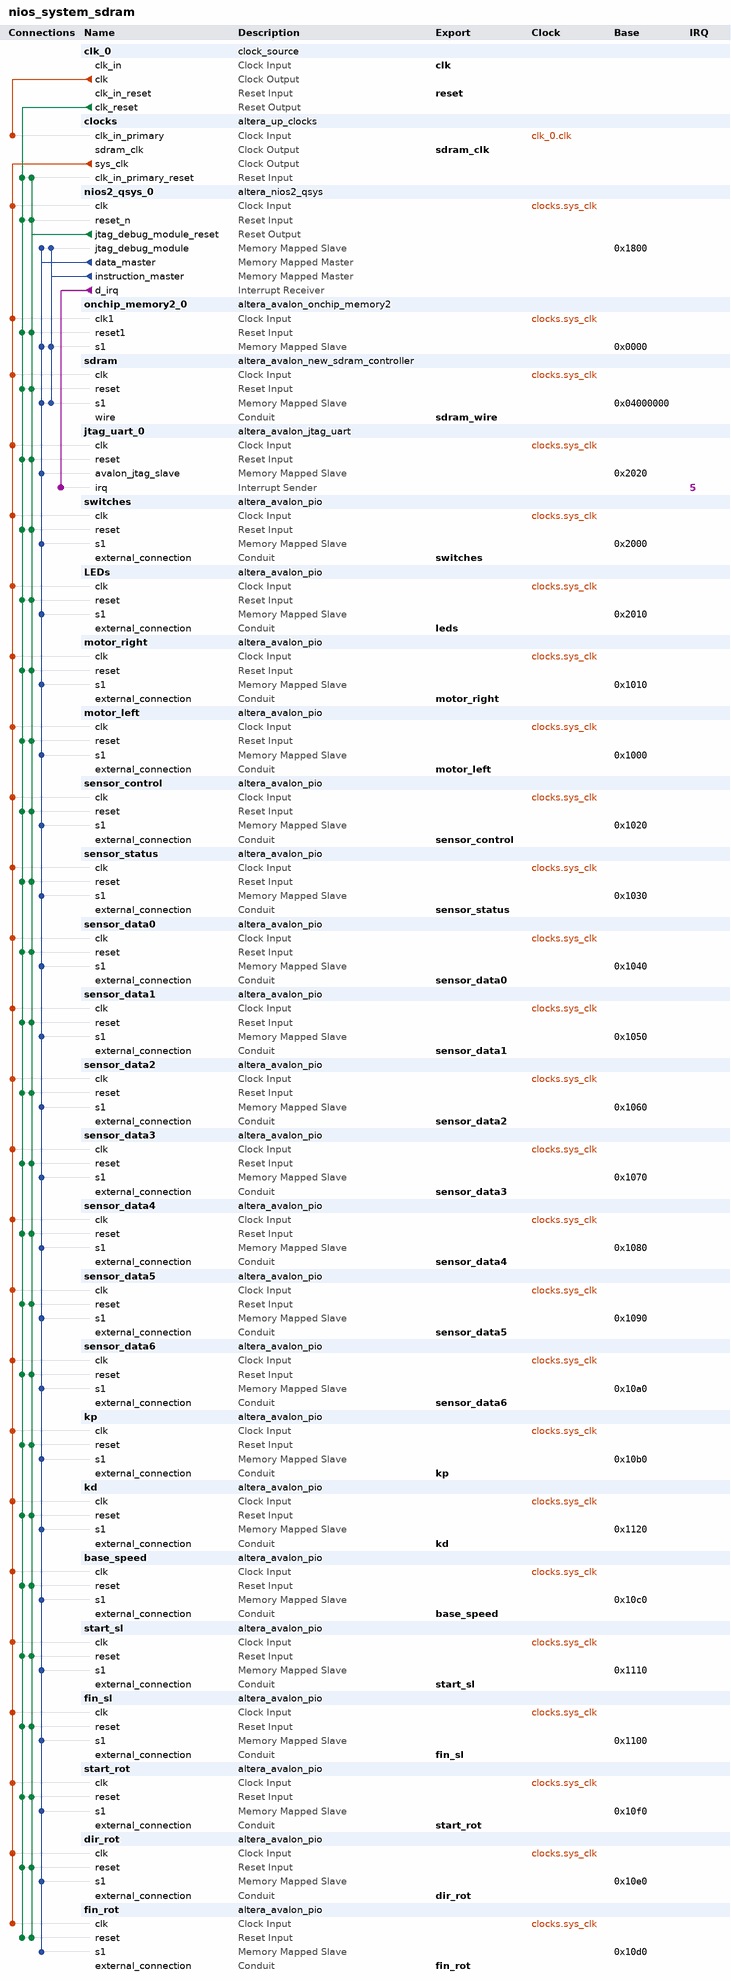
[diagram p0: system contents]
# Platform Designer (Qsys) system nios_system_sdram, Cyclone IV E EP4CE22F17C6
# Parameters at their usual value, and those the tool derives, are not listed.
package require -exact qsys 13.0.1.99.2
create_system nios_system_sdram
set_project_property DEVICE_FAMILY {Cyclone IV E}
set_project_property DEVICE EP4CE22F17C6

add_instance clk_0 clock_source 13.0
set_instance_parameter_value clk_0 clockFrequency 50000000

add_instance clocks altera_up_clocks 13.0
set_instance_parameter_value clocks board DE0-Nano
set_instance_parameter_value clocks vga_clk false
set_instance_parameter_value clocks audio_clk true
set_instance_parameter_value clocks audio_clk_freq 12.288

add_instance nios2_qsys_0 altera_nios2_qsys 13.0
set_instance_parameter_value nios2_qsys_0 resetSlave sdram.s1
set_instance_parameter_value nios2_qsys_0 mmu_TLBMissExcSlave None
set_instance_parameter_value nios2_qsys_0 exceptionSlave sdram.s1
set_instance_parameter_value nios2_qsys_0 breakSlave nios2_qsys_0.jtag_debug_module
set_instance_parameter_value nios2_qsys_0 impl Tiny
set_instance_parameter_value nios2_qsys_0 icache_size 4096

add_instance onchip_memory2_0 altera_avalon_onchip_memory2 13.0.1.99.2
set_instance_parameter_value onchip_memory2_0 dataWidth 32
set_instance_parameter_value onchip_memory2_0 dualPort false
set_instance_parameter_value onchip_memory2_0 initMemContent true
set_instance_parameter_value onchip_memory2_0 initializationFileName onchip_mem.hex
set_instance_parameter_value onchip_memory2_0 memorySize 4096

add_instance sdram altera_avalon_new_sdram_controller 13.0.1.99.2
set_instance_parameter_value sdram TAC 5.5
set_instance_parameter_value sdram TRCD 20.0
set_instance_parameter_value sdram TRP 20.0
set_instance_parameter_value sdram casLatency 3
set_instance_parameter_value sdram columnWidth 9
set_instance_parameter_value sdram dataWidth 16
set_instance_parameter_value sdram generateSimulationModel false
set_instance_parameter_value sdram model single_Micron_MT48LC4M32B2_7_chip
set_instance_parameter_value sdram numberOfBanks 4
set_instance_parameter_value sdram numberOfChipSelects 1
set_instance_parameter_value sdram powerUpDelay 100.0
set_instance_parameter_value sdram refreshPeriod 15.625
set_instance_parameter_value sdram rowWidth 13

add_instance jtag_uart_0 altera_avalon_jtag_uart 13.0.1.99.2
set_instance_parameter_value jtag_uart_0 simInteractiveOptions NO_INTERACTIVE_WINDOWS

add_instance switches altera_avalon_pio 13.0.1.99.2
set_instance_parameter_value switches direction Input
set_instance_parameter_value switches width 8

add_instance LEDs altera_avalon_pio 13.0.1.99.2
set_instance_parameter_value LEDs direction Output
set_instance_parameter_value LEDs width 8

add_instance motor_right altera_avalon_pio 13.0.1.99.2
set_instance_parameter_value motor_right direction Output
set_instance_parameter_value motor_right width 14

add_instance motor_left altera_avalon_pio 13.0.1.99.2
set_instance_parameter_value motor_left direction Output
set_instance_parameter_value motor_left width 14

add_instance sensor_control altera_avalon_pio 13.0.1.99.2
set_instance_parameter_value sensor_control direction Output
set_instance_parameter_value sensor_control width 8

add_instance sensor_status altera_avalon_pio 13.0.1.99.2
set_instance_parameter_value sensor_status direction Input
set_instance_parameter_value sensor_status width 8

add_instance sensor_data0 altera_avalon_pio 13.0.1.99.2
set_instance_parameter_value sensor_data0 direction Input
set_instance_parameter_value sensor_data0 width 8

add_instance sensor_data1 altera_avalon_pio 13.0.1.99.2
set_instance_parameter_value sensor_data1 direction Input
set_instance_parameter_value sensor_data1 width 8

add_instance sensor_data2 altera_avalon_pio 13.0.1.99.2
set_instance_parameter_value sensor_data2 direction Input
set_instance_parameter_value sensor_data2 width 8

add_instance sensor_data3 altera_avalon_pio 13.0.1.99.2
set_instance_parameter_value sensor_data3 direction Input
set_instance_parameter_value sensor_data3 width 8

add_instance sensor_data4 altera_avalon_pio 13.0.1.99.2
set_instance_parameter_value sensor_data4 direction Input
set_instance_parameter_value sensor_data4 width 8

add_instance sensor_data5 altera_avalon_pio 13.0.1.99.2
set_instance_parameter_value sensor_data5 direction Input
set_instance_parameter_value sensor_data5 width 8

add_instance sensor_data6 altera_avalon_pio 13.0.1.99.2
set_instance_parameter_value sensor_data6 direction Input
set_instance_parameter_value sensor_data6 width 8

add_instance kp altera_avalon_pio 13.0.1.99.2
set_instance_parameter_value kp direction Output
set_instance_parameter_value kp resetValue 1000
set_instance_parameter_value kp width 12

add_instance kd altera_avalon_pio 13.0.1.99.2
set_instance_parameter_value kd direction Output
set_instance_parameter_value kd resetValue 50
set_instance_parameter_value kd width 12

add_instance base_speed altera_avalon_pio 13.0.1.99.2
set_instance_parameter_value base_speed direction Output
set_instance_parameter_value base_speed resetValue 1856
set_instance_parameter_value base_speed width 12

add_instance start_sl altera_avalon_pio 13.0.1.99.2
set_instance_parameter_value start_sl direction Output
set_instance_parameter_value start_sl width 1

add_instance fin_sl altera_avalon_pio 13.0.1.99.2
set_instance_parameter_value fin_sl direction Input
set_instance_parameter_value fin_sl width 1

add_instance start_rot altera_avalon_pio 13.0.1.99.2
set_instance_parameter_value start_rot direction Output
set_instance_parameter_value start_rot width 1

add_instance dir_rot altera_avalon_pio 13.0.1.99.2
set_instance_parameter_value dir_rot direction Output
set_instance_parameter_value dir_rot width 1

add_instance fin_rot altera_avalon_pio 13.0.1.99.2
set_instance_parameter_value fin_rot direction Input
set_instance_parameter_value fin_rot width 1

# connections
add_connection clk_0.clk clocks.clk_in_primary clock
add_connection clocks.sys_clk base_speed.clk clock
add_connection clocks.sys_clk dir_rot.clk clock
add_connection clocks.sys_clk fin_rot.clk clock
add_connection clocks.sys_clk fin_sl.clk clock
add_connection clocks.sys_clk jtag_uart_0.clk clock
add_connection clocks.sys_clk kd.clk clock
add_connection clocks.sys_clk kp.clk clock
add_connection clocks.sys_clk LEDs.clk clock
add_connection clocks.sys_clk motor_left.clk clock
add_connection clocks.sys_clk motor_right.clk clock
add_connection clocks.sys_clk nios2_qsys_0.clk clock
add_connection clocks.sys_clk onchip_memory2_0.clk1 clock
add_connection clocks.sys_clk sdram.clk clock
add_connection clocks.sys_clk sensor_control.clk clock
add_connection clocks.sys_clk sensor_data0.clk clock
add_connection clocks.sys_clk sensor_data1.clk clock
add_connection clocks.sys_clk sensor_data2.clk clock
add_connection clocks.sys_clk sensor_data3.clk clock
add_connection clocks.sys_clk sensor_data4.clk clock
add_connection clocks.sys_clk sensor_data5.clk clock
add_connection clocks.sys_clk sensor_data6.clk clock
add_connection clocks.sys_clk sensor_status.clk clock
add_connection clocks.sys_clk start_rot.clk clock
add_connection clocks.sys_clk start_sl.clk clock
add_connection clocks.sys_clk switches.clk clock
add_connection clk_0.clk_reset base_speed.reset reset
add_connection clk_0.clk_reset clocks.clk_in_primary_reset reset
add_connection clk_0.clk_reset dir_rot.reset reset
add_connection clk_0.clk_reset fin_rot.reset reset
add_connection clk_0.clk_reset fin_sl.reset reset
add_connection clk_0.clk_reset jtag_uart_0.reset reset
add_connection clk_0.clk_reset kd.reset reset
add_connection clk_0.clk_reset kp.reset reset
add_connection clk_0.clk_reset LEDs.reset reset
add_connection clk_0.clk_reset motor_left.reset reset
add_connection clk_0.clk_reset motor_right.reset reset
add_connection clk_0.clk_reset nios2_qsys_0.reset_n reset
add_connection clk_0.clk_reset onchip_memory2_0.reset1 reset
add_connection clk_0.clk_reset sdram.reset reset
add_connection clk_0.clk_reset sensor_control.reset reset
add_connection clk_0.clk_reset sensor_data0.reset reset
add_connection clk_0.clk_reset sensor_data1.reset reset
add_connection clk_0.clk_reset sensor_data2.reset reset
add_connection clk_0.clk_reset sensor_data3.reset reset
add_connection clk_0.clk_reset sensor_data4.reset reset
add_connection clk_0.clk_reset sensor_data5.reset reset
add_connection clk_0.clk_reset sensor_data6.reset reset
add_connection clk_0.clk_reset sensor_status.reset reset
add_connection clk_0.clk_reset start_rot.reset reset
add_connection clk_0.clk_reset start_sl.reset reset
add_connection clk_0.clk_reset switches.reset reset
add_connection nios2_qsys_0.jtag_debug_module_reset base_speed.reset reset
add_connection nios2_qsys_0.jtag_debug_module_reset clocks.clk_in_primary_reset reset
add_connection nios2_qsys_0.jtag_debug_module_reset dir_rot.reset reset
add_connection nios2_qsys_0.jtag_debug_module_reset fin_rot.reset reset
add_connection nios2_qsys_0.jtag_debug_module_reset fin_sl.reset reset
add_connection nios2_qsys_0.jtag_debug_module_reset jtag_uart_0.reset reset
add_connection nios2_qsys_0.jtag_debug_module_reset kd.reset reset
add_connection nios2_qsys_0.jtag_debug_module_reset kp.reset reset
add_connection nios2_qsys_0.jtag_debug_module_reset LEDs.reset reset
add_connection nios2_qsys_0.jtag_debug_module_reset motor_left.reset reset
add_connection nios2_qsys_0.jtag_debug_module_reset motor_right.reset reset
add_connection nios2_qsys_0.jtag_debug_module_reset nios2_qsys_0.reset_n reset
add_connection nios2_qsys_0.jtag_debug_module_reset onchip_memory2_0.reset1 reset
add_connection nios2_qsys_0.jtag_debug_module_reset sdram.reset reset
add_connection nios2_qsys_0.jtag_debug_module_reset sensor_control.reset reset
add_connection nios2_qsys_0.jtag_debug_module_reset sensor_data0.reset reset
add_connection nios2_qsys_0.jtag_debug_module_reset sensor_data1.reset reset
add_connection nios2_qsys_0.jtag_debug_module_reset sensor_data2.reset reset
add_connection nios2_qsys_0.jtag_debug_module_reset sensor_data3.reset reset
add_connection nios2_qsys_0.jtag_debug_module_reset sensor_data4.reset reset
add_connection nios2_qsys_0.jtag_debug_module_reset sensor_data5.reset reset
add_connection nios2_qsys_0.jtag_debug_module_reset sensor_data6.reset reset
add_connection nios2_qsys_0.jtag_debug_module_reset sensor_status.reset reset
add_connection nios2_qsys_0.jtag_debug_module_reset start_rot.reset reset
add_connection nios2_qsys_0.jtag_debug_module_reset start_sl.reset reset
add_connection nios2_qsys_0.jtag_debug_module_reset switches.reset reset
add_connection nios2_qsys_0.data_master base_speed.s1 avalon
set_connection_parameter_value nios2_qsys_0.data_master/base_speed.s1 baseAddress 0x10c0
add_connection nios2_qsys_0.data_master dir_rot.s1 avalon
set_connection_parameter_value nios2_qsys_0.data_master/dir_rot.s1 baseAddress 0x10e0
add_connection nios2_qsys_0.data_master fin_rot.s1 avalon
set_connection_parameter_value nios2_qsys_0.data_master/fin_rot.s1 baseAddress 0x10d0
add_connection nios2_qsys_0.data_master fin_sl.s1 avalon
set_connection_parameter_value nios2_qsys_0.data_master/fin_sl.s1 baseAddress 0x1100
add_connection nios2_qsys_0.data_master jtag_uart_0.avalon_jtag_slave avalon
set_connection_parameter_value nios2_qsys_0.data_master/jtag_uart_0.avalon_jtag_slave baseAddress 0x2020
add_connection nios2_qsys_0.data_master kd.s1 avalon
set_connection_parameter_value nios2_qsys_0.data_master/kd.s1 baseAddress 0x1120
add_connection nios2_qsys_0.data_master kp.s1 avalon
set_connection_parameter_value nios2_qsys_0.data_master/kp.s1 baseAddress 0x10b0
add_connection nios2_qsys_0.data_master LEDs.s1 avalon
set_connection_parameter_value nios2_qsys_0.data_master/LEDs.s1 baseAddress 0x2010
add_connection nios2_qsys_0.data_master motor_left.s1 avalon
set_connection_parameter_value nios2_qsys_0.data_master/motor_left.s1 baseAddress 0x1000
add_connection nios2_qsys_0.data_master motor_right.s1 avalon
set_connection_parameter_value nios2_qsys_0.data_master/motor_right.s1 baseAddress 0x1010
add_connection nios2_qsys_0.data_master nios2_qsys_0.jtag_debug_module avalon
set_connection_parameter_value nios2_qsys_0.data_master/nios2_qsys_0.jtag_debug_module baseAddress 0x1800
add_connection nios2_qsys_0.data_master onchip_memory2_0.s1 avalon
set_connection_parameter_value nios2_qsys_0.data_master/onchip_memory2_0.s1 baseAddress 0x0000
add_connection nios2_qsys_0.data_master sdram.s1 avalon
set_connection_parameter_value nios2_qsys_0.data_master/sdram.s1 baseAddress 0x04000000
add_connection nios2_qsys_0.data_master sensor_control.s1 avalon
set_connection_parameter_value nios2_qsys_0.data_master/sensor_control.s1 baseAddress 0x1020
add_connection nios2_qsys_0.data_master sensor_data0.s1 avalon
set_connection_parameter_value nios2_qsys_0.data_master/sensor_data0.s1 baseAddress 0x1040
add_connection nios2_qsys_0.data_master sensor_data1.s1 avalon
set_connection_parameter_value nios2_qsys_0.data_master/sensor_data1.s1 baseAddress 0x1050
add_connection nios2_qsys_0.data_master sensor_data2.s1 avalon
set_connection_parameter_value nios2_qsys_0.data_master/sensor_data2.s1 baseAddress 0x1060
add_connection nios2_qsys_0.data_master sensor_data3.s1 avalon
set_connection_parameter_value nios2_qsys_0.data_master/sensor_data3.s1 baseAddress 0x1070
add_connection nios2_qsys_0.data_master sensor_data4.s1 avalon
set_connection_parameter_value nios2_qsys_0.data_master/sensor_data4.s1 baseAddress 0x1080
add_connection nios2_qsys_0.data_master sensor_data5.s1 avalon
set_connection_parameter_value nios2_qsys_0.data_master/sensor_data5.s1 baseAddress 0x1090
add_connection nios2_qsys_0.data_master sensor_data6.s1 avalon
set_connection_parameter_value nios2_qsys_0.data_master/sensor_data6.s1 baseAddress 0x10a0
add_connection nios2_qsys_0.data_master sensor_status.s1 avalon
set_connection_parameter_value nios2_qsys_0.data_master/sensor_status.s1 baseAddress 0x1030
add_connection nios2_qsys_0.data_master start_rot.s1 avalon
set_connection_parameter_value nios2_qsys_0.data_master/start_rot.s1 baseAddress 0x10f0
add_connection nios2_qsys_0.data_master start_sl.s1 avalon
set_connection_parameter_value nios2_qsys_0.data_master/start_sl.s1 baseAddress 0x1110
add_connection nios2_qsys_0.data_master switches.s1 avalon
set_connection_parameter_value nios2_qsys_0.data_master/switches.s1 baseAddress 0x2000
add_connection nios2_qsys_0.instruction_master nios2_qsys_0.jtag_debug_module avalon
set_connection_parameter_value nios2_qsys_0.instruction_master/nios2_qsys_0.jtag_debug_module baseAddress 0x1800
add_connection nios2_qsys_0.instruction_master onchip_memory2_0.s1 avalon
set_connection_parameter_value nios2_qsys_0.instruction_master/onchip_memory2_0.s1 baseAddress 0x0000
add_connection nios2_qsys_0.instruction_master sdram.s1 avalon
set_connection_parameter_value nios2_qsys_0.instruction_master/sdram.s1 baseAddress 0x04000000
add_connection nios2_qsys_0.d_irq jtag_uart_0.irq interrupt
set_connection_parameter_value nios2_qsys_0.d_irq/jtag_uart_0.irq irqNumber 5

# exported interfaces
add_interface clk clock sink
set_interface_property clk EXPORT_OF clk_0.clk_in
add_interface switches conduit end
set_interface_property switches EXPORT_OF switches.external_connection
add_interface leds conduit end
set_interface_property leds EXPORT_OF LEDs.external_connection
add_interface sdram_wire conduit end
set_interface_property sdram_wire EXPORT_OF sdram.wire
add_interface reset reset sink
set_interface_property reset EXPORT_OF clk_0.clk_in_reset
add_interface motor_left conduit end
set_interface_property motor_left EXPORT_OF motor_left.external_connection
add_interface motor_right conduit end
set_interface_property motor_right EXPORT_OF motor_right.external_connection
add_interface sdram_clk clock source
set_interface_property sdram_clk EXPORT_OF clocks.sdram_clk
add_interface sensor_control conduit end
set_interface_property sensor_control EXPORT_OF sensor_control.external_connection
add_interface sensor_status conduit end
set_interface_property sensor_status EXPORT_OF sensor_status.external_connection
add_interface sensor_data1 conduit end
set_interface_property sensor_data1 EXPORT_OF sensor_data1.external_connection
add_interface sensor_data0 conduit end
set_interface_property sensor_data0 EXPORT_OF sensor_data0.external_connection
add_interface sensor_data2 conduit end
set_interface_property sensor_data2 EXPORT_OF sensor_data2.external_connection
add_interface sensor_data3 conduit end
set_interface_property sensor_data3 EXPORT_OF sensor_data3.external_connection
add_interface sensor_data4 conduit end
set_interface_property sensor_data4 EXPORT_OF sensor_data4.external_connection
add_interface sensor_data5 conduit end
set_interface_property sensor_data5 EXPORT_OF sensor_data5.external_connection
add_interface sensor_data6 conduit end
set_interface_property sensor_data6 EXPORT_OF sensor_data6.external_connection
add_interface kp conduit end
set_interface_property kp EXPORT_OF kp.external_connection
add_interface start_sl conduit end
set_interface_property start_sl EXPORT_OF start_sl.external_connection
add_interface fin_sl conduit end
set_interface_property fin_sl EXPORT_OF fin_sl.external_connection
add_interface start_rot conduit end
set_interface_property start_rot EXPORT_OF start_rot.external_connection
add_interface dir_rot conduit end
set_interface_property dir_rot EXPORT_OF dir_rot.external_connection
add_interface fin_rot conduit end
set_interface_property fin_rot EXPORT_OF fin_rot.external_connection
add_interface base_speed conduit end
set_interface_property base_speed EXPORT_OF base_speed.external_connection
add_interface kd conduit end
set_interface_property kd EXPORT_OF kd.external_connection

set_interconnect_requirement {$system} qsys_mm.clockCrossingAdapter HANDSHAKE
set_interconnect_requirement {$system} qsys_mm.maxAdditionalLatency 1

save_system nios_system_sdram.qsys
